# EAGLE design Smart Driver Adapter PadMod (EAGLE 9.6.2)
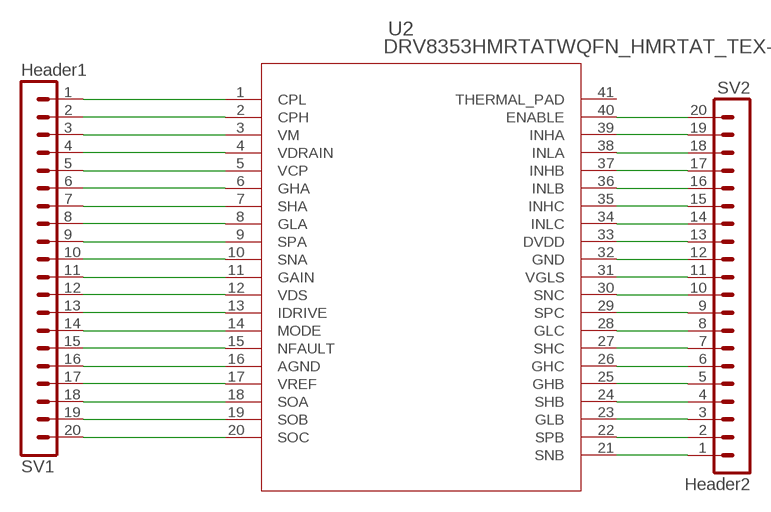
[diagram p0: schematic, sheet 1]

## Parts
SV1  Header1  MA20-1  [MA20-1]
SV2  Header2  MA20-1  [MA20-1]
U2  DRV8353HMRTATWQFN_HMRTAT_TEX-M  [WQFN_HMRTAT_TEX-M]

## Nets
N$1: SV1.1 U2.1(CPL)
N$2: SV1.14 U2.14(MODE)
N$3: SV1.2 U2.2(CPH)
N$4: SV1.3 U2.3(VM)
N$5: SV1.4 U2.4(VDRAIN)
N$6: SV1.5 U2.5(VCP)
N$7: SV1.6 U2.6(GHA)
N$8: SV1.7 U2.7(SHA)
N$9: SV1.8 U2.8(GLA)
N$10: SV1.9 U2.9(SPA)
N$11: SV1.10 U2.10(SNA)
N$12: SV1.11 U2.11(GAIN)
N$13: SV1.13 U2.13(IDRIVE)
N$14: SV1.15 U2.15(NFAULT)
N$15: SV1.16 U2.16(AGND)
N$16: SV1.17 U2.17(VREF)
N$17: SV1.18 U2.18(SOA)
N$18: SV1.20 U2.20(SOC)
N$19: SV2.20 U2.40(ENABLE)
N$20: SV2.19 U2.39(INHA)
N$21: SV2.18 U2.38(INLA)
N$22: SV2.17 U2.37(INHB)
N$23: SV2.16 U2.36(INLB)
N$24: SV2.15 U2.35(INHC)
N$25: SV2.14 U2.34(INLC)
N$26: SV2.13 U2.33(DVDD)
N$27: SV2.12 U2.32(GND)
N$28: SV2.11 U2.31(VGLS)
N$29: SV2.10 U2.30(SNC)
N$30: SV2.9 U2.29(SPC)
N$31: SV2.8 U2.28(GLC)
N$32: SV2.7 U2.27(SHC)
N$33: SV2.6 U2.26(GHC)
N$34: SV2.5 U2.25(GHB)
N$35: SV2.4 U2.24(SHB)
N$36: SV2.3 U2.23(GLB)
N$37: SV2.2 U2.22(SPB)
N$38: SV2.1 U2.21(SNB)
N$39: SV1.12 U2.12(VDS)
N$40: SV1.19 U2.19(SOB)
Unconnected: U2.41(THERMAL_PAD)

## Library data of the parts
SV1 SV2 = Modified_Header:MA20-1: PIN HEADER; OC_FARNELL: unknown; OC_NEWARK: unknown
U2 = DRV8353SMRTAT_ModPad:DRV8353HMRTAT; COPYRIGHT: Copyright (C) 2021 Ultra Librarian. All rights reserved.; DIGI-KEY_PART_NUMBER_1: 296-DRV8353HMRTATTR-ND; DIGI-KEY_PART_NUMBER_2: 296-DRV8353HMRTATCT-ND; DIGI-KEY_PART_NUMBER_3: 296-DRV8353HMRTATDKR-ND; MANUFACTURER_PART_NUMBER: DRV8353HMRTAT; MFR_NAME: Texas Instruments

## Board
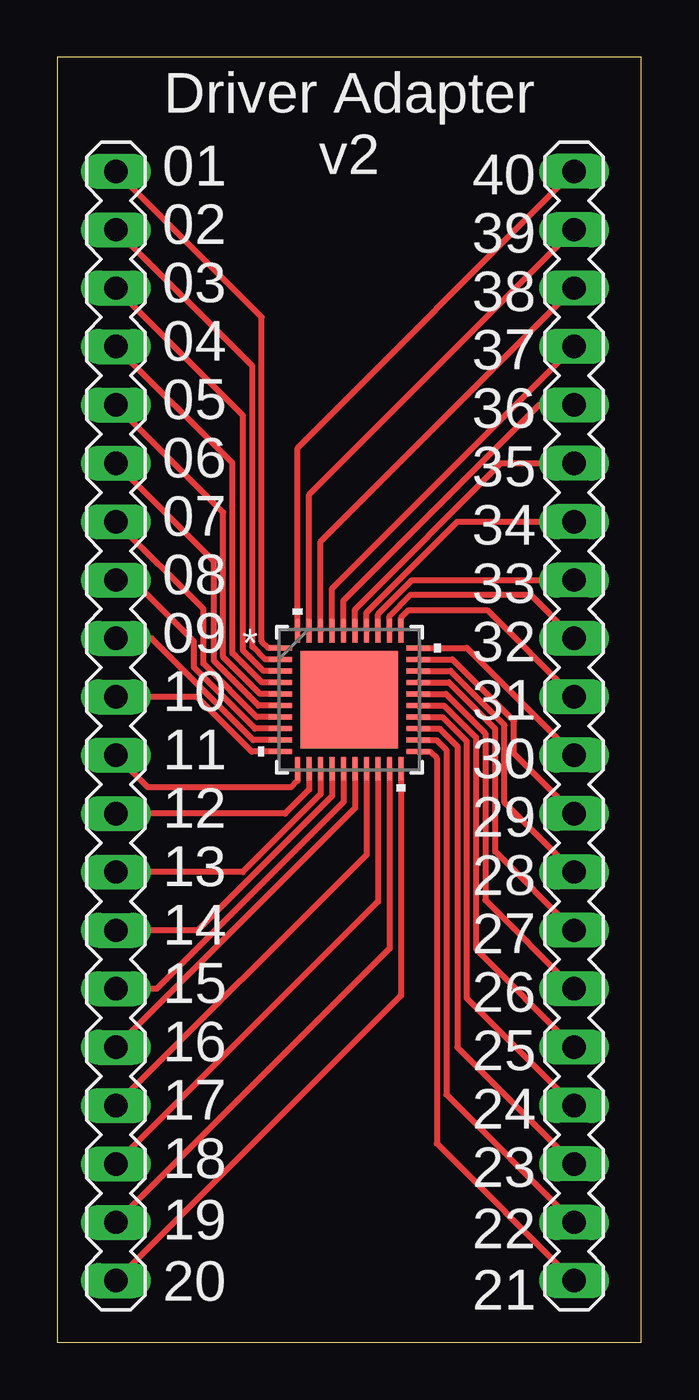
[diagram p1: board, top side]

Size 25.4 x 55.88 mm. Coordinates in mm from the lower left corner, seen from the top.
Outline: 0,0 25.4,0 25.4,55.88 0,55.88 0,0
Copper layers (1*16): Top 0.035mm / dielectric 1.5mm / Bottom 0.035mm
Design rules "default": minimum track width 6mil, minimum drill 0.35mm, track to track 6mil, track to pad 6mil, pad to pad 6mil, via to via 6mil, smd to smd 6mil, copper to edge 40mil, drill to drill 6mil, minimum pad ring 10mil, minimum via ring 8mil, stop-mask expansion 4mil, vias tented up to drill 0mil, thermal gap 10mil

### Footprints (pad centres in the part's own frame; a part is rotated, then mirrored left to right if it is on the bottom)
MA20-1 = drill 1.016 long: 1 -24.13,0; 2 -21.59,0; 3 -19.05,0; 4 -16.51,0; 5 -13.97,0; 6 -11.43,0; 7 -8.89,0; 8 -6.35,0; 9 -3.81,0; 10 -1.27,0; 11 1.27,0; 12 3.81,0; 13 6.35,0; 14 8.89,0; 15 11.43,0; 16 13.97,0; 17 16.51,0; 18 19.05,0; 19 21.59,0; 20 24.13,0
WQFN_HMRTAT_TEX-M = smd 1.016 x 0.229: 1 -2.997,2.251; 2 -2.997,1.75; 3 -2.997,1.25; 4 -2.997,0.75; 5 -2.997,0.25; 6 -2.997,-0.25; 7 -2.997,-0.75; 8 -2.997,-1.25; 9 -2.997,-1.75; 10 -2.997,-2.251; 21 2.997,-2.251; 22 2.997,-1.75; 23 2.997,-1.25; 24 2.997,-0.75; 25 2.997,-0.25; 26 2.997,0.25; 27 2.997,0.75; 28 2.997,1.25; 29 2.997,1.75; 30 2.997,2.251 | smd 0.229 x 1.016: 11 -2.251,-2.997; 12 -1.75,-2.997; 13 -1.25,-2.997; 14 -0.75,-2.997; 15 -0.25,-2.997; 16 0.25,-2.997; 17 0.75,-2.997; 18 1.25,-2.997; 19 1.75,-2.997; 20 2.251,-2.997; 31 2.251,2.997; 32 1.75,2.997; 33 1.25,2.997; 34 0.75,2.997; 35 0.25,2.997; 36 -0.25,2.997; 37 -0.75,2.997; 38 -1.25,2.997; 39 -1.75,2.997; 40 -2.251,2.997 | smd 4.242 x 4.242: 41 0,0

### Placement (x,y rotation side)
SV1  2.54,26.8 270 top
SV2  22.48,26.8 90 top
U2  12.7,27.94 0 top

### Tracks (layer width: path | path; a pad name or v marks a point on that pad's centre or on a via)
N$1
  Top 0.254: SV1.1 8.89,44.58 8.89,30.48 9.18,30.19 U2.1
N$2
  Top 0.254: SV1.14 6.1,17.91 11.95,23.76 U2.14
N$3
  Top 0.254: SV1.2 8.48,42.44 8.48,30.25 9.04,29.69 U2.2
N$4
  Top 0.254: SV1.3 8.08,40.31 8.08,30.08 8.97,29.19 U2.3
N$5
  Top 0.254: SV1.4 7.62,38.23 7.62,29.97 8.63,28.95 8.89,28.69 U2.4
N$6
  Top 0.254: SV1.5 7.21,36.09 7.21,29.8 8.82,28.19 U2.5
N$7
  Top 0.254: SV1.6 6.81,33.96 6.81,29.63 8.75,27.69 U2.6
N$8
  Top 0.254: SV1.7 6.35,31.88 6.35,29.51 8.67,27.19 U2.7
N$9
  Top 0.254: SV1.8 3.28,33.15 5.94,30.48 5.94,29.34 8.6,26.69 U2.8
N$10
  Top 0.254: SV1.9 4.11,30.61 8.52,26.19 U2.9
N$11
  Top 0.254: SV1.10 6.07,28.07 8.45,25.69 U2.10
N$12
  Top 0.254: SV1.11 3.94,24.13 10.16,24.13 10.45,24.42 U2.11
N$13
  Top 0.254: SV1.13 8.06,20.45 11.45,23.84 U2.13
N$14
  Top 0.254: SV1.15 4.32,15.37 12.45,23.5 U2.15
N$15
  Top 0.254: SV1.16 12.95,23.24 U2.16
N$16
  Top 0.254: SV1.17 13.45,21.2 U2.17
N$17
  Top 0.254: SV1.18 13.95,19.16 U2.18
N$18
  Top 0.254: SV1.20 14.95,15.08 U2.20
N$19
  Top 0.254: SV2.20 10.45,38.9 U2.40
N$20
  Top 0.254: SV2.19 10.95,36.86 U2.39
N$21
  Top 0.254: SV2.18 11.45,34.82 U2.38
N$22
  Top 0.254: SV2.17 11.95,32.78 U2.37
N$23
  Top 0.254: SV2.16 20.95,40.77 12.45,32.26 U2.36
N$24
  Top 0.254: SV2.15 19.3,38.23 12.95,31.87 U2.35
N$25
  Top 0.254: SV2.14 17.4,35.69 13.45,31.74 U2.34
N$26
  Top 0.254: SV2.13 15.43,33.15 13.95,31.66 U2.33
N$27
  Top 0.254: SV2.12 20.58,32.51 15.37,32.51 14.45,31.59 U2.32
N$28
  Top 0.254: SV2.11 18.71,31.84 15.28,31.84 14.95,31.51 U2.31
N$29
  Top 0.254: SV2.10 17.82,30.19 U2.30
N$30
  Top 0.254: SV2.9 19.86,25.6 19.86,27.01 17.18,29.69 U2.29
N$31
  Top 0.254: SV2.8 19.46,23.47 19.46,26.84 17.1,29.19 U2.28
N$32
  Top 0.254: SV2.7 19.05,21.34 19.05,26.67 17.03,28.69 U2.27
N$33
  Top 0.254: SV2.6 18.62,19.23 18.62,26.47 16.9,28.19 U2.26
N$34
  Top 0.254: SV2.5 18.21,17.09 18.21,26.3 16.83,27.69 U2.25
N$35
  Top 0.254: SV2.4 17.8,14.96 17.8,26.14 16.75,27.19 U2.24
N$36
  Top 0.254: SV2.3 17.4,12.83 17.4,25.91 16.62,26.69 U2.23
N$37
  Top 0.254: SV2.2 16.92,10.77 16.92,25.76 16.48,26.19 U2.22
N$38
  Top 0.254: SV2.1 16.51,8.64 16.51,25.4 16.22,25.69 U2.21
N$39
  Top 0.254: SV1.12 9.91,22.99 10.95,24.03 U2.12
N$40
  Top 0.254: SV1.19 14.45,17.12 U2.19

### Text on the board
tPlace: Driver Adapter / v2 | 01 | 40 | 02 | 39 | 03 | 38 | 04 | 37 | 05 | 36 | 06 | 35 | 07 | 34 | 08 | 33 | 09 | 32 | 10 | 31 | 11 | 30 | 12 | 29 | 13 | 28 | 14 | 27 | 15 | 26 | 16 | 25 | 17 | 24 | 18 | 23 | 19 | 22 | 20 | 21